# Altium schematic sheet Misc.SchDoc
size A; SheetNumber: 1; SheetTotal: 5
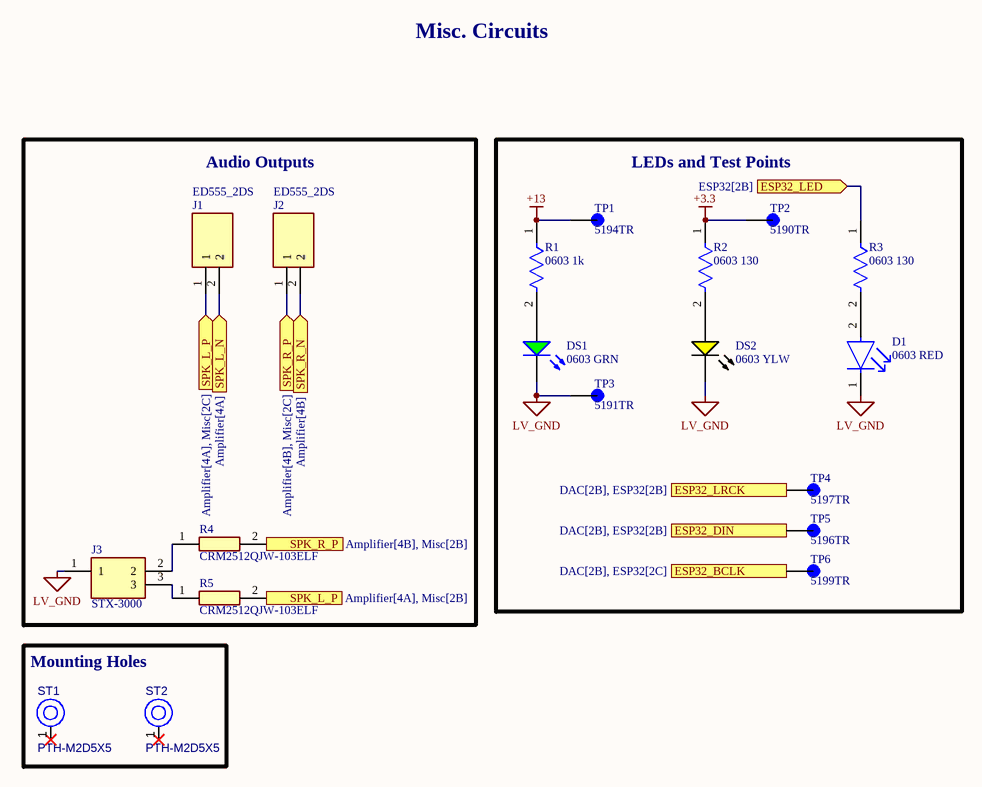
[diagram p0: Misc.SchDoc]

## Parts
D1  0603 RED  [FP-SML-LX0603IW-TR-MFG]
DS1  0603 GRN  [LUMX-SML-LX0603_V]
DS2  0603 YLW  [LUMX-SML-LX0603_V]
J1  ED555_2DS  [SHDR2W90P0X350_1X2_700X650X820P]
J2  ED555_2DS  [SHDR2W90P0X350_1X2_700X650X820P]
J3  STX-3000  [STX3000]
R1  0603 1k  [FP-CRCW0603-e3-MFG]
R2  0603 130  [FP-CRCW0603-e3-MFG]
R3  0603 130  [FP-CRCW0603-e3-MFG]
R4  CRM2512QJW-103ELF  [RESC6331X80N]
R5  CRM2512QJW-103ELF  [RESC6331X80N]
ST1  PTH-M2D5X5  [PTH-M2D5X5]
ST2  PTH-M2D5X5  [PTH-M2D5X5]
TP1  5194TR  [KEYSTONE_5194TR]
TP2  5190TR  [KEYSTONE_5190TR]
TP3  5191TR  [KEYSTONE_5191TR]
TP4  5197TR  [KEYSTONE_5197TR]
TP5  5196TR  [KEYSTONE_5196TR]
TP6  5199TR  [KEYSTONE_5199TR]

## Blocks framed on the sheet
Audio Outputs: J1-J3 R4 R5
LEDs and Test Points: D1 DS1 DS2 R1-R3 TP1-TP6
Mounting Holes: ST1 ST2

## Ports
ESP32_BCLK (see DAC[2B], ESP32[2C]), ESP32_DIN (see DAC[2B], ESP32[2B]), ESP32_LED (in, see ESP32[2B]), ESP32_LRCK (see DAC[2B], ESP32[2B]), SPK_L_N (in, see Amplifier[4A]), SPK_L_P (in, see Amplifier[4A], Misc[2B]), SPK_L_P (in, see Amplifier[4A], Misc[2C]), SPK_R_N (in, see Amplifier[4B]), SPK_R_P (in, see Amplifier[4B], Misc[2B]), SPK_R_P (in, see Amplifier[4B], Misc[2C])

## Nets
+3.3: R2.1 TP2.TP
+13: R1.1 TP1.TP
LV_GND: D1.1(C) DS1.2(K) DS2.2(K) J3.1 TP3.TP
ESP32_BCLK: TP6.TP ; port ESP32_BCLK
ESP32_DIN: TP5.TP ; port ESP32_DIN
ESP32_LED: R3.1 ; port ESP32_LED
ESP32_LRCK: TP4.TP ; port ESP32_LRCK
SPK_L_N: J1.2 ; port SPK_L_N
SPK_L_P: J1.1 R5.2 ; port SPK_L_P
SPK_R_N: J2.2 ; port SPK_R_N
SPK_R_P: J2.1 R4.2 ; port SPK_R_P
NetD1_2: D1.2(A) R3.2
NetDS1_1: DS1.1(A) R1.2
NetDS2_1: DS2.1(A) R2.2
NetJ3_2: J3.2 R4.1
NetJ3_3: J3.3 R5.1

Not connected (* = marked no-connect by the designer): ST1 1(H1)*; ST2 1(H1)*

## Notes on the sheet
- Misc. Circuits

## Library data of the parts
D1 = CMP-57192-000012-1: LED RED DIFFUSED SMD; Luminous Intensity: 14mcd; Test Current: 20mA; Viewing Angle: 160°; Approvals: UL; Forward Voltage: 2V; Power Dissipation: 50mW; Dominant Wavelength: 635nm; Number of LEDs: 1; Lens Color: White; Height: 0.6mm; RoHS Compliant: Yes; Lead Free: Lead Free; Number of Pins: 2; Packaging: Tape and Reel; Case/Package: 0603; Length: 1.6mm; Color: Red; Max Operating Temperature: 85°C; Illumination Color: Red; Case Code (Metric): 1608; Diameter: 0.061inch; Min Operating Temperature: -25°C; Lens Style: Diffused; Mount: Surface Mount; Width: 0.8mm; Case Code (Imperial): 0603; Lens Transparency: Diffused; Wavelength: 635nm; Package Quantity: 1; Forward Current: 20mA
DS1 = CMP-2000-07120-1: LED Green Diode, 18 mcd, 50 mW, -25 to 85 degC, 2-Pin SMD, RoHS, Tape and Reel; Manufacturer: Lumex; Part No: SML-LX0603GW-TR; Peak Wavelength: 565nm; Viewing Angle: 160; LED Material: GaP; COO: CN; Lens Appearance: ColorlessDiffused; Pin_Count: 2; Type: Uni-Color; Intensity: 18mcd; Number of LEDs: 1; Reverse Voltage: 5(Min)V; Supplier: Lumex; ECCN: EAR99; Packaging: TapeandReel; Supplier Standard Pack: 4,000; Mounting: SurfaceMount; Operating Temperature: -25to85C; Package Description: 2-Pin Surface Mount Device, Body 1.6 x 0.8 mm; Family: SML-LX0603GW; Lens Dimensions: 1x0.8x0.3mm; Dominant Wavelength: N/A; Package Reference: SML-LX00603; HTS: 8541402000; Mounting Technology: SurfaceMount; Datasheet Version: Rev. G, 09/2013; Manufacturer URL: http://www.lumexinstruments.com/; RoHS: Yes; Datasheet URL: http://www.lumex.com/content/files/ProductAttachment/SML-LX0603GW-TR.pdf; Supplier_Package: SMD; Color: Green; Dimension: 1.6x0.8x0.6mm
DS2 = CMP-2000-07121-1: Yellow LED, Milky White Diffused Lens, 2.1 V, 14 mcd, -25 to 85 degC, 2-Pin SMD, RoHS, Tape and Reel; Manufacturer: Lumex; Part No: SML-LX0603YW-TR; COO: CN; Number of LEDs: 1; Type: Uni-Color; Intensity: 14mcd; Reverse Voltage: 5(Min)V; LED Material: GaAsP; Viewing Angle: 160; Peak Wavelength: 585nm; Pin_Count: 2; Lens Appearance: ColorlessDiffused; Operating Temperature: -25to85C; Color: Yellow; Mounting Technology: SurfaceMount; Package Description: 2-Pin Surface Mount Device, Body 1.6 x 0.8 mm; Mounting: SurfaceMount; Packaging: TapeandReel; RoHS: Unknown; Supplier_Package: SMD; Package Reference: SML-LX00603; Datasheet URL: http://www.lumex.com/content/files/ProductAttachment/SML-LX0603YW-TR.pdf; Dimension: 1.6x0.8x0.6mm; Manufacturer URL: http://www.lumexinstruments.com/; HTS: 8541402000; Datasheet Version: Rev. G, 09/2013; Lens Dimensions: 1x0.8x0.3mm; Dominant Wavelength: N/A; ECCN: EARII; Supplier: Lumex; Family: SML-LX0603YW
J1 J2 = ED555_2DS: Connector; Manufacturer_Name: On Shore Technology Inc.; Manufacturer_Part_Number: ED555/2DS; Datasheet Link: http://www.on-shore.com/wp-content/uploads/ED555XDS.pdf; Height: 8.2mm; Arrow Part Number: ED555/2DS; Arrow Price/Stock: https://www.arrow.com/en/products/ed5552ds/on-shore-technology?utm_currency=USD&region=nac
J3 = STX-3000: Connector; Manufacturer_Name: Kycon; Datasheet Link: http://www.kycon.com/Pub_Eng_Draw/STX-3000.pdf; Manufacturer_Part_Number: STX-3000; Mouser Part Number: 806-STX-3000; Mouser Price/Stock: https://www.mouser.co.uk/ProductDetail/Kycon/STX-3000?qs=kjZ2mQLP346Nbz1X9BOzfg%3D%3D
R1 = CMP-1666-00003-5: RES Thick Film, 1kΩ, 1%, 0.1W, 100ppm/°C, 0603; Max Power Dissipation: 100mW; Voltage Rating: 75V; Resistance: 1kR; Max Operating Temperature: 155°C; Number of Pins: 2; Case Code (Imperial): 0603; Width: 0.033inch; Power Rating: 100mW; Number of Terminations: 2; Package Quantity: 10; Weight: 7.1E-05oz; Tolerance: 1%; Temperature Coefficient: 100ppm/°C; Military Standard: Not; Mount: Surface Mount; Voltage Rating (DC): 75V; Depth: 0.85mm; Composition: Thick Film; Radiation Hardening: No; Termination: SMD/SMT; Length: 1.55mm; Case Code (Metric): 1608; Contact Plating: Tin; Min Operating Temperature: -55°C; Packaging: Tape and Reel; Height: 0.45mm; Lead Free: Lead Free; Case/Package: 0603; Features: Automotive AEC-Q200
R2 R3 = CMP-2000-03889-2: RES Thick Film, 130Ω, 1%, 0.1W, 100ppm/°C, 0603; Working Voltage: 75V; Power Rating: 100mW; Resistance: 130R; Depth: 0.85mm; Max Operating Temperature: 155°C; Width: 0.85mm; Composition: Thick Film; Radiation Hardening: No; Contact Plating: Tin; Tolerance: 1%; Number of Pins: 2; Length: 1.55mm; Case/Package: 0603; Features: Automotive AEC-Q200; Case Code (Metric): 1608; Min Operating Temperature: -55°C; Package Quantity: 10; Temperature Coefficient: 100ppm/°C; Packaging: Tape and Reel; Lead Free: Lead Free; Number of Terminations: 2; Voltage Rating (DC): 75V; Termination: SMD/SMT; Height: 0.45mm; Military Standard: Not; Max Power Dissipation: 100mW; Voltage Rating: 75V; Weight: 7.1E-05oz; Case Code (Imperial): 0603
R4 R5 = CRM2512QJW-103ELF: Resistor; Manufacturer_Name: Bourns; Datasheet Link: http://www.bourns.com/data/global/pdfs/CRM0805_1206_2010.pdf; Height: 0.8mm; Manufacturer_Part_Number: CRM2512QJW-103ELF; Mouser Part Number: 652-CRM2512QJW-103E; Mouser Price/Stock: https://www.mouser.co.uk/ProductDetail/Bourns/CRM2512QJW-103ELF?qs=8Wlm6%252BaMh8Rzg3bRHdWGsA%3D%3D; Arrow Part Number: CRM2512QJW-103ELF; Arrow Price/Stock: https://www.arrow.com/en/products/crm2512qjw-103elf/bourns?region=nac
ST1 ST2 = CMP-00028-00004-2: M2 PTH (2.5mm), 5mm pad; Pins: 1
TP1 = CMP-137-000011-1: Color Keyed SMT Test Point -Yellow; MF: Keystone Electronics; Design Item ID: 5194TR; Check_prices: https://www.snapeda.com/parts/5194TR/Keystone+Electronics/view-part/?ref=eda; MP: 5194TR; Source: 5194TR.SchLib; Value: *; SnapEDA_Link: https://www.snapeda.com/parts/5194TR/Keystone+Electronics/view-part/?ref=snap; Pin Count: 1; Package: None; Component Type: Standard
TP2 = CMP-137-000010-1: Color Keyed SMT Test Point -Red; MF: Keystone Electronics; Package: None; Check_prices: https://www.snapeda.com/parts/5190TR/Keystone+Electronics/view-part/?ref=eda; Design Item ID: 5190TR; Value: *; Component Type: Standard; Source: 5190TR.SchLib; MP: 5190TR; SnapEDA_Link: https://www.snapeda.com/parts/5190TR/Keystone+Electronics/view-part/?ref=snap; Pin Count: 1
TP3 = CMP-137-000007-1: Color Keyed SMT Test Point -Black; MF: Keystone Electronics; SnapEDA_Link: https://www.snapeda.com/parts/5191TR/Keystone+Electronics/view-part/?ref=snap; Component Type: Standard; Value: *; Source: 5191TR.SchLib; Design Item ID: 5191TR; Check_prices: https://www.snapeda.com/parts/5191TR/Keystone+Electronics/view-part/?ref=eda; Package: None; MP: 5191TR; Pin Count: 1
TP4 = CMP-137-000006-1: Color Keyed SMT Test Point - Blue; MF: Keystone Electronics; Value: *; SnapEDA_Link: https://www.snapeda.com/parts/5197TR/Keystone+Electronics/view-part/?ref=snap; Component Type: Standard; Design Item ID: 5197TR; MP: 5197TR; Pin Count: 1; Check_prices: https://www.snapeda.com/parts/5197TR/Keystone+Electronics/view-part/?ref=eda; Package: None; Source: 5197TR.SchLib
TP5 = CMP-137-000008-1: Color Keyed SMT Test Point -Green; MF: Keystone Electronics; Package: None; Pin Count: 1; MP: 5196TR; Value: *; Design Item ID: 5196TR; Component Type: Standard; Check_prices: https://www.snapeda.com/parts/5196TR/Keystone+Electronics/view-part/?ref=eda; Source: 5196TR.SchLib; SnapEDA_Link: https://www.snapeda.com/parts/5196TR/Keystone+Electronics/view-part/?ref=snap
TP6 = CMP-137-000009-1: Color Keyed SMT Test Point -Purple; MF: Keystone Electronics; Design Item ID: 5199TR; Check_prices: https://www.snapeda.com/parts/5199TR/Keystone+Electronics/view-part/?ref=eda; MP: 5199TR; Component Type: Standard; Pin Count: 1; Value: *; SnapEDA_Link: https://www.snapeda.com/parts/5199TR/Keystone+Electronics/view-part/?ref=snap; Source: 5199TR.SchLib; Package: None